# Altium schematic sheet SOC POWER CAPS & SOC VSS.SchDoc
size A2; DocumentNumber: 3; SheetNumber: 4; SheetTotal: 14
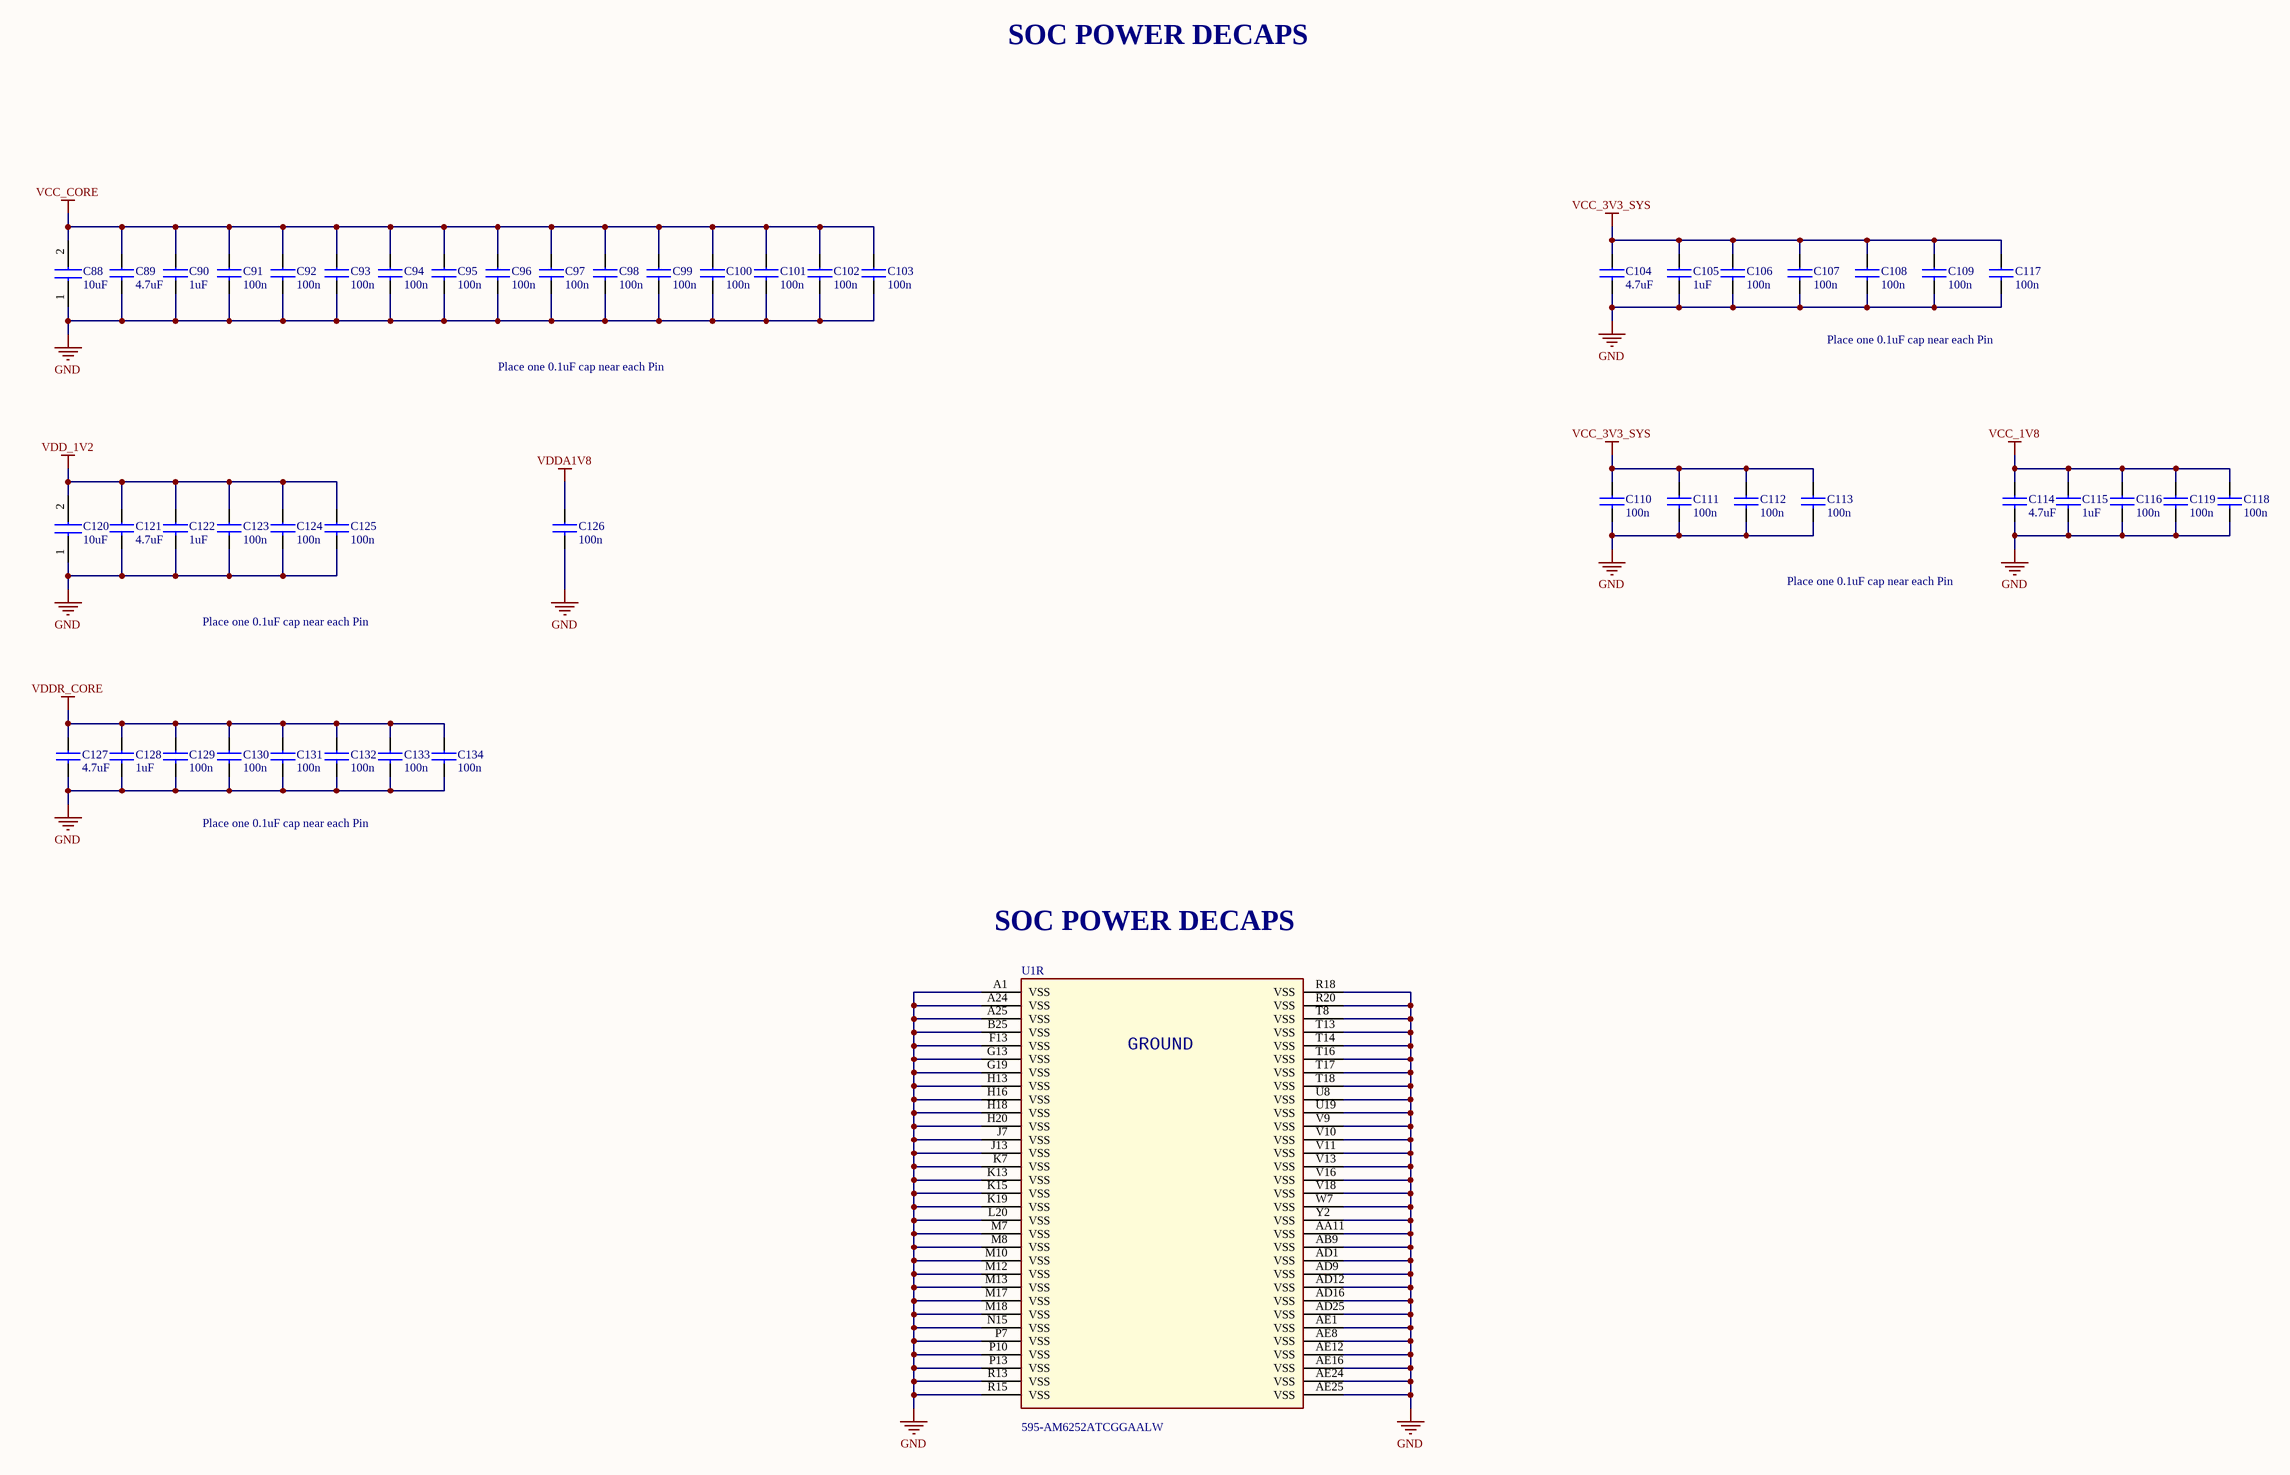
[diagram p0: SOC POWER CAPS & SOC VSS.SchDoc]

## Parts
C88  10uF  [C0603]
C89  4.7uF  [C0201]
C90  1uF  [C0201]
C91  100n  [C0201]
C92  100n  [C0201]
C93  100n  [C0201]
C94  100n  [C0201]
C95  100n  [C0201]
C96  100n  [C0201]
C97  100n  [C0201]
C98  100n  [C0201]
C99  100n  [C0201]
C100  100n  [C0201]
C101  100n  [C0201]
C102  100n  [C0201]
C103  100n  [C0201]
C104  4.7uF  [C0201]
C105  1uF  [C0201]
C106  100n  [C0201]
C107  100n  [C0201]
C108  100n  [C0201]
C109  100n  [C0201]
C110  100n  [C0201]
C111  100n  [C0201]
C112  100n  [C0201]
C113  100n  [C0201]
C114  4.7uF  [C0201]
C115  1uF  [C0201]
C116  100n  [C0201]
C117  100n  [C0201]
C118  100n  [C0201]
C119  100n  [C0201]
C120  10uF  [C0603]
C121  4.7uF  [C0201]
C122  1uF  [C0201]
C123  100n  [C0201]
C124  100n  [C0201]
C125  100n  [C0201]
C126  100n  [C0201]
C127  4.7uF  [C0201]
C128  1uF  [C0201]
C129  100n  [C0201]
C130  100n  [C0201]
C131  100n  [C0201]
C132  100n  [C0201]
C133  100n  [C0201]
C134  100n  [C0201]
U1  Supplier Part Number 1: 595-AM6252ATCGGAALW  [BGA425C50P25X25_1300X1300X89]  (hidden comment: AM62-EVM_BGA425)  (part R of 18)

## Nets
GND: C88.1 C89.2 C90.2 C91.2 C92.2 C93.2 C94.2 C95.2 C96.2 C97.2 C98.2 C99.2 C100.2 C101.2 C102.2 C103.2 C104.2 C105.2 C106.2 C107.2 C108.2 C109.2 C110.2 C111.2 C112.2 C113.2 C114.2 C115.2 C116.2 C117.2 C118.2 C119.2 C120.1 C121.2 C122.2 C123.2 C124.2 C125.2 C126.2 C127.2 C128.2 C129.2 C130.2 C131.2 C132.2 C133.2 C134.2 U1.A1(VSS) U1.A24(VSS) U1.A25(VSS) U1.AA11(VSS) U1.AB9(VSS) U1.AD1(VSS) U1.AD9(VSS) U1.AD12(VSS) U1.AD16(VSS) U1.AD25(VSS) U1.AE1(VSS) U1.AE8(VSS) U1.AE12(VSS) U1.AE16(VSS) U1.AE24(VSS) U1.AE25(VSS) U1.B25(VSS) U1.F13(VSS) U1.G13(VSS) U1.G19(VSS) U1.H13(VSS) U1.H16(VSS) U1.H18(VSS) U1.H20(VSS) U1.J7(VSS) U1.J13(VSS) U1.K7(VSS) U1.K13(VSS) U1.K15(VSS) U1.K19(VSS) U1.L20(VSS) U1.M7(VSS) U1.M8(VSS) U1.M10(VSS) U1.M12(VSS) U1.M13(VSS) U1.M17(VSS) U1.M18(VSS) U1.N15(VSS) U1.P7(VSS) U1.P10(VSS) U1.P13(VSS) U1.R13(VSS) U1.R15(VSS) U1.R18(VSS) U1.R20(VSS) U1.T8(VSS) U1.T13(VSS) U1.T14(VSS) U1.T16(VSS) U1.T17(VSS) U1.T18(VSS) U1.U8(VSS) U1.U19(VSS) U1.V9(VSS) U1.V10(VSS) U1.V11(VSS) U1.V13(VSS) U1.V16(VSS) U1.V18(VSS) U1.W7(VSS) U1.Y2(VSS)
VCC_1V8: C114.1 C115.1 C116.1 C118.1 C119.1
VCC_3V3_SYS: C104.1 C105.1 C106.1 C107.1 C108.1 C109.1 C110.1 C111.1 C112.1 C113.1 C117.1
VCC_CORE: C88.2 C89.1 C90.1 C91.1 C92.1 C93.1 C94.1 C95.1 C96.1 C97.1 C98.1 C99.1 C100.1 C101.1 C102.1 C103.1
VDD_1V2: C120.2 C121.1 C122.1 C123.1 C124.1 C125.1
VDDA1V8: C126.1
VDDR_CORE: C127.1 C128.1 C129.1 C130.1 C131.1 C132.1 C133.1 C134.1

## Notes on the sheet
- SOC POWER DECAPS
- Place one 0.1uF cap near each Pin
- (in symbol AM62-EVM_BGA425, part R) GROUND

## Library data of the parts
C88 C120 = CL10A106MQ8NNNC: 10 µF ±20% 6.3V Ceramic Capacitor X5R 0603 (1608 Metric); Manufacturer_Name: SAMSUNG; Manufacturer Part Number: CL03A474KQ3NNNC; Capacitance: 470nF; Tolerance: 10%; Datasheet Link: http://uk.rs-online.com/web/p/products/7664718; Height: 0.9mm; Manufacturer_Part_Number: CL10A106MQ8NNNC; Mouser Part Number: 187-CL10A106MQ8NNNC; Mouser Price/Stock: https://www.mouser.co.uk/ProductDetail/Samsung-Electro-Mechanics/CL10A106MQ8NNNC?qs=349EhDEZ59qlB6a%2FjjeGAg%3D%3D; Arrow Part Number: CL10A106MQ8NNNC; Arrow Price/Stock: https://www.arrow.com/en/products/cl10a106mq8nnnc/samsung-electro-mechanics?region=nac; Manufacturer: Samsung; Mount: Surface Mount; Case/Package: 0201; Case Code (Metric): 0603; Case Code (Imperial): 0201; Min Operating Temperature: -55°C; Max Operating Temperature: 85°C; Package Quantity: 1; Packaging: Cut Tape; Voltage Rating: 6.3V; Series: CL; Voltage Rating (DC): 6.3V; Length: 0.024inch; Width: 0.012inch; Thickness: 0.013inch; RoHS Compliant: Yes; Lead Free: Lead Free; Supplier 1: Digi-Key; Stock 1: 2081153; Pricing 1: 1=0.11, 10=0.083, 50=0.0452, 100=0.0369, 500=0.0264, 1000=0.0207 (USD); Contact Plating: Tin; Dielectric: X5R; Voltage: 6.3V; Construction: Flat; Depth: 0.8mm; Radiation Hardening: No; ComponentLink1URL: https://datasheet.ciiva.com/25798/cl10a106mq8nnnc-25798320.pdf?src-supplier=Digi-Key; ComponentLink1Description: https://datasheet.ciiva.com/25798/cl10a106mq8nnnc-25798320.pdf?src-supplier=Digi-Key; ComponentLink2URL: https://datasheet.ciiva.com/26838/getdatasheetpartid-357557-26838347.pdf?src-supplier=Verical; ComponentLink2Description: https://datasheet.ciiva.com/26838/getdatasheetpartid-357557-26838347.pdf?src-supplier=Verical; ComponentLink3URL: https://datasheet.ciiva.com/16437/cl05b104kq5nnnc-16437327.pdf?src-supplier=Future+Electronics; ComponentLink3Description: https://datasheet.ciiva.com/16437/cl05b104kq5nnnc-16437327.pdf?src-supplier=Future+Electronics; Supplier Part Number 1: 1276-1119-6-ND
C89 C104 C114 C121 C127 = GRM035R60J475ME15D: CAP CER 4.7UF 6.3V X5R 0201; Manufacturer: Murata; Tolerance: 20%; Supplier 1: Digi-Key; Manufacturer Part Number: GRM035R60J475ME15D; Stock 1: 1730472; Pricing 1: 10000=0.044, 50000=0.0377, 100000=0.0333, 250000=0.0331 (USD); Mount: Surface Mount; Case/Package: 0201; Case Code (Metric): 0603; Case Code (Imperial): 0201; Min Operating Temperature: -55°C; Max Operating Temperature: 85°C; Packaging: Cut Tape; Series: GRM; Capacitance: 4.7uF; Voltage Rating: 6.3V; Voltage Rating (DC): 6.3V; Dielectric: X5R; Length: 0.024inch; Width: 0.012inch; Thickness: 0.022inch; RoHS Compliant: Yes; ComponentLink1URL: https://datasheet.octopart.com/GRM035R60J475ME15D-Murata-datasheet-140089765.pdf?src-supplier=Future+Electronics; ComponentLink1Description: https://datasheet.octopart.com/GRM035R60J475ME15D-Murata-datasheet-140089765.pdf?src-supplier=Future+Electronics; ComponentLink2URL: http://www.farnell.com/datasheets/2853106.pdf?src-supplier=Farnell; ComponentLink2Description: http://www.farnell.com/datasheets/2853106.pdf?src-supplier=Farnell; ComponentLink3URL: http://www.farnell.com/datasheets/2853106.pdf?src-supplier=Newark; ComponentLink3Description: http://www.farnell.com/datasheets/2853106.pdf?src-supplier=Newark; ComponentLink4URL: https://datasheet.octopart.com/GRM035R60J475ME15D-Murata-datasheet-149522819.pdf?src-supplier=Farnell; ComponentLink4Description: https://datasheet.octopart.com/GRM035R60J475ME15D-Murata-datasheet-149522819.pdf?src-supplier=Farnell; ComponentLink5URL: http://search.murata.co.jp/Ceramy/image/img/A01X/G101/ENG/GRM035R60J475ME15-01.pdf?src-supplier=Digi-Key; ComponentLink5Description: http://search.murata.co.jp/Ceramy/image/img/A01X/G101/ENG/GRM035R60J475ME15-01.pdf?src-supplier=Digi-Key; ComponentLink6URL: https://datasheet.octopart.com/GRM035R60J475ME15D-Murata-datasheet-165579666.pdf?src-supplier=TME; ComponentLink6Description: https://datasheet.octopart.com/GRM035R60J475ME15D-Murata-datasheet-165579666.pdf?src-supplier=TME; Supplier Part Number 1: 490-13230-2-ND
C90 C105 C115 C122 C128 = CL03A105KQ3CSNC: CAP CER 1UF 6.3V X5R 0201; Manufacturer: Samsung; Tolerance: 10%; Supplier 1: Digi-Key; Manufacturer Part Number: CL03A105KQ3CSNC; Stock 1: 1049900; Pricing 1: 10000=0.0226, 20000=0.0215, 30000=0.0204, 50000=0.0187, 100000=0.0154, 250000=0.0141 (USD); Mount: Surface Mount; Case/Package: 0201; Case Code (Metric): 0603; Case Code (Imperial): 0201; Contact Plating: Tin; Min Operating Temperature: -55°C; Max Operating Temperature: 85°C; Capacitance: 1uF; Packaging: Tape and Reel; Voltage Rating: 6.3V; Dielectric: X5R; Series: CL; Construction: Flat; Length: 0.6mm; Width: 0.012inch; Height: 0.3mm; Thickness: 0.013inch; Depth: 0.3mm; Radiation Hardening: No; RoHS Compliant: Yes; ComponentLink1URL: https://datasheet.ciiva.com/18699/cl03a105kq3csnc-18699129.pdf?src-supplier=Digi-Key; ComponentLink1Description: https://datasheet.ciiva.com/18699/cl03a105kq3csnc-18699129.pdf?src-supplier=Digi-Key; ComponentLink2URL: https://datasheet.ciiva.com/26838/getdatasheetpartid-355153-26838086.pdf?src-supplier=Verical; ComponentLink2Description: https://datasheet.ciiva.com/26838/getdatasheetpartid-355153-26838086.pdf?src-supplier=Verical; Supplier Part Number 1: 1276-1323-2-ND
C91-C103 C106-C113 C116-C119 C123-C126 C129-C134 = C0603X5R1C104K030BC: CAP CER 0.1UF 16V 10% X5R 0201; Manufacturer: TDK Corporation; Capacitance: 0.1µF; .Creator: MM; Supplier 1: Digi-Key; Manufacturer Part Number: C0603X5R1C104K030BC; RoHS: RoHS Compliant; Category: Capacitors; Stock 1: 19491; Pricing 1: 1=0.1, 10=0.046, 100=0.0209, 250=0.01712, 500=0.01464, 1000=0.0114, 5000=0.0095 (USD); Packaging: Cut Tape (CT); Tolerance: ±10%; Voltage - Rated: 16V; Temperature Coefficient: X5R; Mounting Type: Surface Mount, MLCC; Operating Temperature: -55°C ~ 85°C; Applications: General Purpose; Ratings: -; Package / Case: 0201 (0603 Metric); Size / Dimension: 0.024" L x 0.012" W (0.60mm x 0.30mm); Height - Seated (Max): -; Thickness (Max): 0.013" (0.33mm); Lead Spacing: -; Features: -; Lead Style: -; ComponentLink1URL: http://product.tdk.com/en/catalog/datasheets/mlcc_commercial_general_en.pdf; ComponentLink1Description: http://product.tdk.com/en/catalog/datasheets/mlcc_commercial_general_en.pdf; Supplier Part Number 1: 445-7313-1-ND; .Checked PCB: MM; .Checked SCH: MM
U1 = AM62-EVM_BGA425: ARM® Cortex®-A53 Microprocessor IC Sitara™ 2 Core, 64-Bit 1.4GHz 425-FCCSP (13x13); Manufacturer: Texas Instruments; Manufacturer Part Number: AM6252ATCGGAALW; Supplier 1: Mouser; Stock 1: 0; Pricing 1: 1=21.23, 10=19.58, 50=18.7, 100=18.7, 1000=15.94, 10000=15.94 (USD)